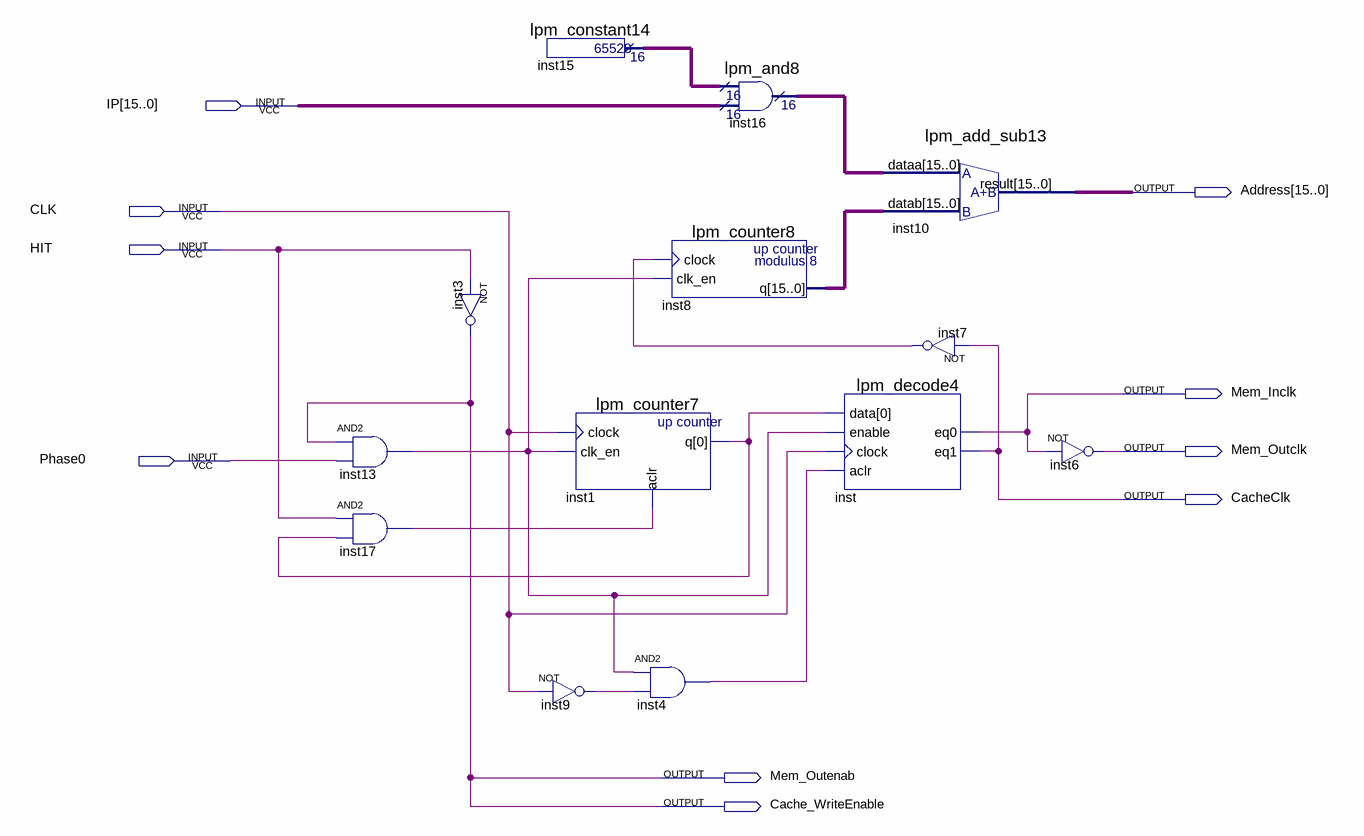
[diagram p0: schematic sheet]
// Quartus schematic LoadAlgorithm.bdf as structural Verilog: 13 symbols, 10 pins
module LoadAlgorithm (
  input  [15:0] IP,
  input  CLK,
  input  HIT,
  input  Phase0,
  output [15:0] Address,
  output Mem_Inclk,
  output Mem_Outclk,
  output CacheClk,
  output Mem_Outenab,
  output Cache_WriteEnable
);

  wire inst1_q, inst4_out, inst7_out, inst9_out, inst13_out, inst17_out;
  wire [15:0] inst8_q, inst15_result, inst16_result;

  and inst13 (inst13_out, Cache_WriteEnable, Phase0);
  and inst17 (inst17_out, HIT, inst1_q);
  not inst3 (Cache_WriteEnable, HIT);
  lpm_constant14 inst15 (.result(inst15_result));
  lpm_counter7 inst1 (.clock(CLK), .clk_en(inst13_out), .aclr(inst17_out), .q(inst1_q));
  not inst9 (inst9_out, CLK);
  and inst4 (inst4_out, inst13_out, inst9_out);
  lpm_counter8 inst8 (.clock(inst7_out), .clk_en(inst13_out), .q(inst8_q));
  lpm_and8 inst16 (.data0x(inst15_result), .data1x(IP), .result(inst16_result));
  lpm_decode4 inst (
    .data(inst1_q), .enable(inst13_out), .clock(CLK), .aclr(inst4_out), .eq0(Mem_Inclk), .eq1(CacheClk));
  lpm_add_sub13 inst10 (.dataa(inst16_result), .datab(inst8_q), .result(Address));
  not inst7 (inst7_out, CacheClk);
  not inst6 (Mem_Outclk, Mem_Inclk);

  assign Mem_Outenab = Cache_WriteEnable;
endmodule
